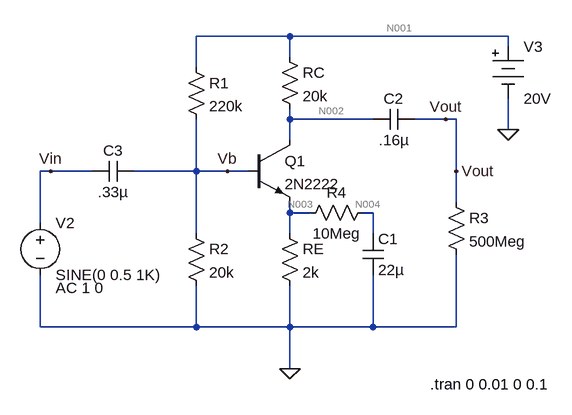
[diagram p0: schematic ampli_2N2222.asc]
ampli_2N2222.asc, the LTspice schematic file:
Version 4.1
SHEET 1 880 680
WIRE 288 -32 144 -32
WIRE 624 -32 288 -32
WIRE 624 -16 624 -32
WIRE 288 0 288 -32
WIRE 144 16 144 -32
WIRE 288 96 288 80
WIRE 416 96 288 96
WIRE 528 96 480 96
WIRE 544 96 528 96
WIRE 624 112 624 64
WIRE 288 128 288 96
WIRE -80 176 -96 176
WIRE -16 176 -80 176
WIRE 144 176 144 96
WIRE 144 176 48 176
WIRE 192 176 144 176
WIRE 224 176 192 176
WIRE 544 176 544 96
WIRE 544 224 544 176
WIRE 288 240 288 224
WIRE 320 240 288 240
WIRE 416 240 400 240
WIRE -96 256 -96 176
WIRE 144 272 144 176
WIRE 288 272 288 240
WIRE 416 272 416 240
WIRE -96 416 -96 336
WIRE 144 416 144 352
WIRE 144 416 -96 416
WIRE 288 416 288 352
WIRE 288 416 144 416
WIRE 416 416 416 336
WIRE 416 416 288 416
WIRE 544 416 544 304
WIRE 544 416 416 416
WIRE 288 480 288 416
FLAG 288 480 0
FLAG 624 112 0
FLAG 544 176 Vout
FLAG 192 176 Vb
FLAG -80 176 Vin
FLAG 528 96 Vout
SYMBOL res 272 256 R0
SYMATTR InstName RE
SYMATTR Value 2k
SYMBOL res 272 -16 R0
SYMATTR InstName RC
SYMATTR Value 20k
SYMBOL npn 224 128 R0
SYMATTR InstName Q1
SYMATTR Value 2N2222
SYMBOL voltage -96 240 R0
WINDOW 123 24 116 Left 2
WINDOW 39 0 0 Left 0
SYMATTR Value2 AC 1 0
SYMATTR InstName V2
SYMATTR Value SINE(0 0.5 1K)
SYMBOL Misc\\battery 624 -32 R0
WINDOW 123 0 0 Left 0
WINDOW 39 0 0 Left 0
SYMATTR InstName V3
SYMATTR Value 20V
SYMBOL cap 400 272 R0
SYMATTR InstName C1
SYMATTR Value 22µ
SYMBOL res 128 0 R0
SYMATTR InstName R1
SYMATTR Value 220k
SYMBOL res 128 256 R0
SYMATTR InstName R2
SYMATTR Value 20k
SYMBOL cap 480 80 R90
WINDOW 0 0 32 VBottom 2
WINDOW 3 32 32 VTop 2
SYMATTR InstName C2
SYMATTR Value .16µ
SYMBOL res 528 208 R0
SYMATTR InstName R3
SYMATTR Value 500Meg
SYMBOL cap 48 160 R90
WINDOW 0 0 32 VBottom 2
WINDOW 3 32 32 VTop 2
SYMATTR InstName C3
SYMATTR Value .33µ
SYMBOL res 416 224 R90
WINDOW 0 0 56 VBottom 2
WINDOW 3 32 56 VTop 2
SYMATTR InstName R4
SYMATTR Value 10Meg
TEXT 504 504 Left 2 !.tran 0 0.01 0 0.1

The netlist it stands for:
* ampli_2N2222.asc
RE N003 0 2k
RC N001 N002 20k
Q1 N002 Vb N003 0 2N2222
V2 Vin 0 SINE(0 0.5 1K) AC 1 0
V3 N001 0 20V
C1 N004 0 22µ
R1 N001 Vb 220k
R2 Vb 0 20k
C2 Vout N002 .16µ
R3 Vout 0 500Meg
C3 Vb Vin .33µ
R4 N004 N003 10Meg
.model NPN NPN
.model PNP PNP
.lib standard.bjt
.tran 0 0.01 0 0.1
.backanno
.end

* Results of the author's LTspice run, read from the files saved beside the schematic
* Operating Point, zero values left out:
*   V(n001) = 20 V
*   V(vb) = 1.625 V
*   V(n003) = 990.1 mV
*   V(n002) = 10.14 V
*   V(n004) = 990.1 mV
*   I(RE) = 495.1 µA
*   Ic(Q1) = 492.8 µA
*   Ib(Q1) = 2.274 µA
*   Ie(Q1) = -495.1 µA
*   I(R2) = 81.25 µA
*   I(V3) = -576.3 µA
*   I(RC) = 492.8 µA
*   I(R1) = 83.52 µA
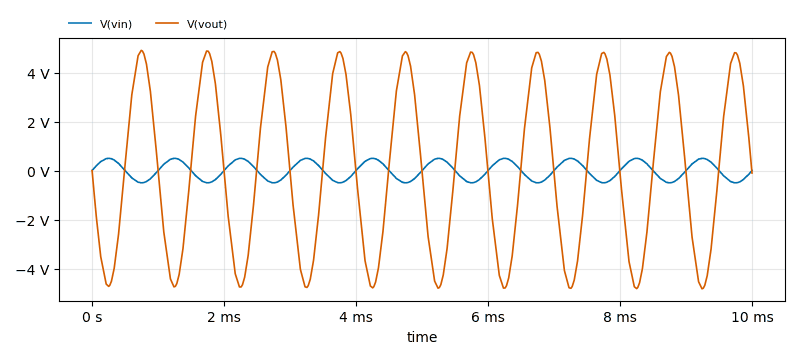
[diagram p1: Transient Analysis of ampli_2N2222.asc, plotted from the saved traces]
* Transient Analysis, 1 run:
*   V(vin): min -499.9 mV, max 500 mV, average -5.562 µV, rms 359 mV, last 0 V
*   V(vout): min -4.823 V, max 4.904 V, average 49.13 mV, rms 3.461 V, last -100.4 mV